# Altium schematic sheet Connectors.SchDoc: Connectors
size A3; DocumentNumber: 2; SheetNumber: 2; SheetTotal: 3
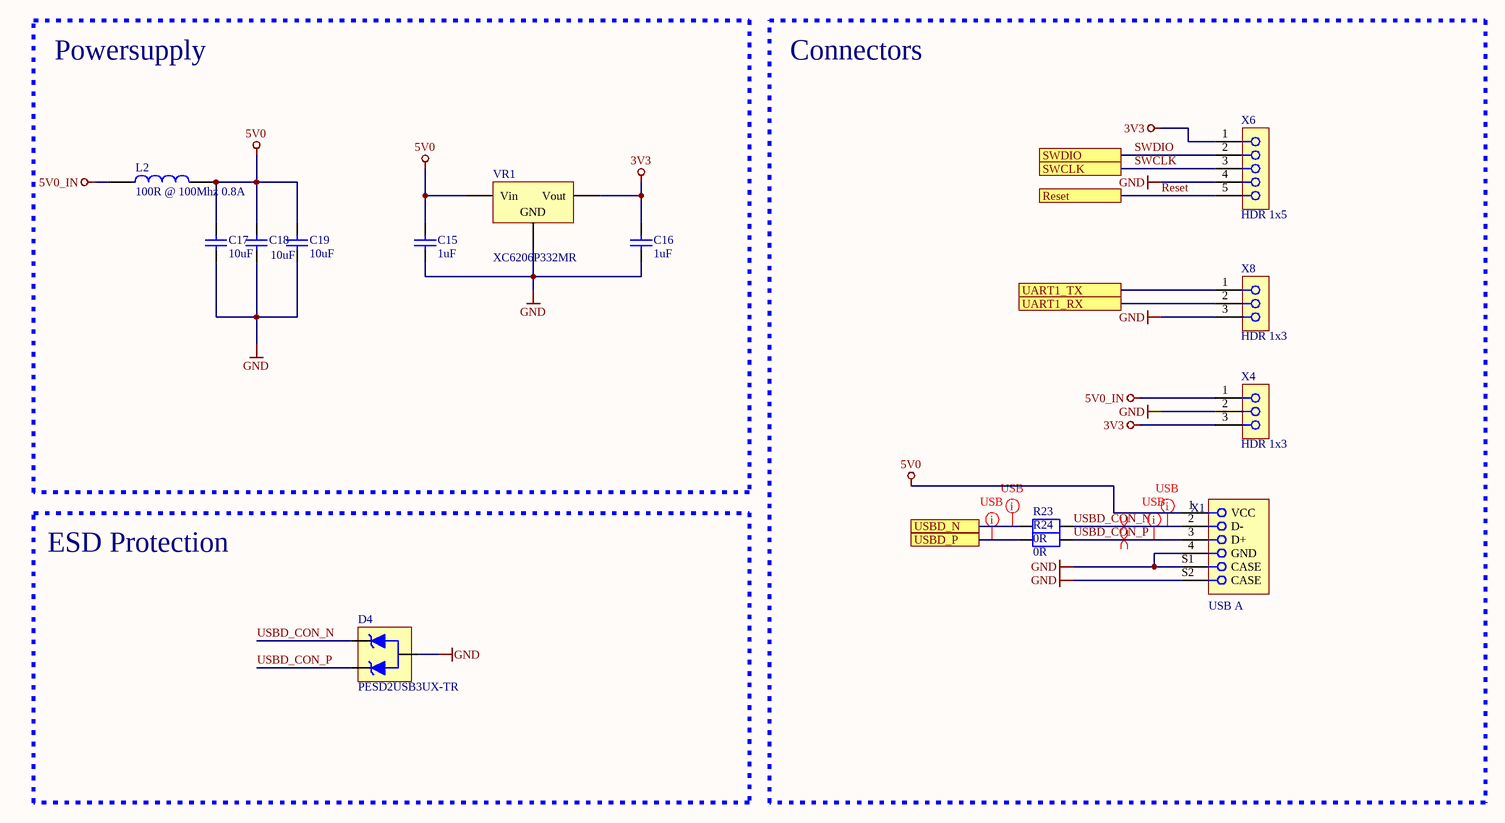
[diagram p0: Connectors.SchDoc]

## Parts
C15  1uF  [0603_C]
C16  1uF  [0603_C]
C17  10uF  [0805_C]
C18  10uF  [0805_C]
C19  10uF  [0805_C]
D4  PESD2USB3UX-TR  [SOT95P280X135-3N_123]
L2  100R @ 100Mhz 0.8A  [6-0805_L]
R23  0R  [RESC2012X70N]
R24  0R  [RESC2012X70N]
VR1  XC6206P332MR  [SOT-23-3L]
X1  USB A  [CON_USBA_F_61400416021]
X4  HDR 1x3  [CON_HEADER2.54_1x3W]
X6  HDR 1x5  [CON_HEADER2.54_1x5W]
X8  HDR 1x3  [CON_HEADER2.54_1x3W]

## Blocks framed on the sheet
Powersupply: C15-C19 L2 VR1
Connectors: R23 R24 X1 X4 X6 X8
ESD Protection: D4

## Ports
Reset, SWCLK, SWDIO, UART1_RX, UART1_TX, USBD_N, USBD_P

## Nets
3V3: C16.2 VR1.2(Vout) X4.3 X6.1
5V0: C15.2 C17.2 C18.2 C19.2 L2.2 VR1.3(Vin) X1.1(VCC)
5V0_IN: L2.1 X4.1
GND: C15.1 C16.1 C17.1 C18.1 C19.1 D4.3 VR1.1(GND) X1.4(GND) X1.S1(CASE) X1.S2(CASE) X4.2 X6.4 X8.3
Reset: X6.5 ; port Reset
SWCLK: X6.3 ; port SWCLK
SWDIO: X6.2 ; port SWDIO
UART1_RX: X8.2 ; port UART1_RX
UART1_TX: X8.1 ; port UART1_TX
USBD_CON_N: D4.1 R23.2 X1.2(D-)
USBD_CON_P: D4.2 R24.2 X1.3(D+)
USBD_N: R23.1 ; port USBD_N
USBD_P: R24.1 ; port USBD_P

## Layout directives
differential pair; net class USB; differential pair class USB_Line; rule Differential Pairs Routing [Pref Gap = 0.15mm    Min Gap  = 0.15mm    Max Gap  = 0.15mmPref Width = 0.5mm    Min Width  = 0.15mm    Max Width  = 0.5mm]: USBD_CON_N, USBD_CON_P
net class USB: USBD_CON_N, USBD_CON_P, USBD_N, USBD_P

## Notes on the sheet
- Title
- Size:
- Date:
- File:
- A4
- Revision:
- Sheet
- of
- Creator:
- Document Type: Schematic Drawing
- Approval Person:

## Library data of the parts
C15 C16 = 0603 1uF (105) 10% 50V: Chip capacitors; Manufacturer: Samsung Electro-Mechanics; PartNumber: CL10A105KB8NNNC; Tolerance: 10%; Voltage: 50V; ComponentLink1Description: Supplier link; ComponentLink1URL: http://www.szlcsc.com/product/details_16531.html; Package: 0603; Supplier: LC; SuppliersPartNumber: C15849; Capacitance: 1uF
C17-C19 = 0805 10uF (106) 10% 25V: Chip capacitors; Manufacturer: Samsung Electro-Mechanics; PartNumber: CL21A106KAYNNNE; Tolerance: 10%; Voltage: 25V; ComponentLink1Description: Supplier link; ComponentLink1URL: http://www.szlcsc.com/product/details_16532.html; Package: 0805; Supplier: LC; SuppliersPartNumber: C15850; Capacitance: 10uF
D4 = PESD2USB3UX-TR: ESD Suppressors / TVS Diodes DIODE ESD PROT; Manufacturer: Nexperia; Voltage Rating: 3.3V; Alternatives allowed: YES; Manufacturer Part Number: PESD2USB3UX-TR
L2 = 0805 100R@100Mhz 0.8A: Ferrite Bead; Notepad: *; Package: 0805; Supplier: Sunlord; SuppliersPartNumber: C1015
R23 R24 = RES_0R_0805: Thick Film Resistors - SMD 1/8watt ZEROohm Jumper; Manufacturer: Vishay; Manufacturer Part Number: CRCW08050000Z0EA; Voltage Rating: 150V; Tolerance: 1%; Alternatives allowed: YES; JLC: C17477
VR1 = SOT-23 XC6206P332MR: 低压差线性稳压(LDO); ComponentLink1Description: 供应商链接; ComponentLink1URL: http://www.szlcsc.com/product/details_5896.html; Package: SOT-23; Supplier: LC; SuppliersPartNumber: C5446
X1 = CON_USB_A_FEMALE: USB 2.0 Type A Horizontal; Manufacturer Part Number: 61400416021; Manufacturer: WURTH ELEKTRONIK; Lumira Part Number: S-QMS-SPEC-32510; Alternatives allowed: NO; Notes: *; Tolerance: *; Voltage Rating: *
X4 X8 = CON_HEADER_1X3: Board-to-Board-Steckverbinder, 2.54 mm, 3 Kontakt(e), Stiftleiste 1-Reihig; Manufacturer: Samtec; Manufacturer Part Number: TSW-103-07-T-S; Lumira Part Number: S-QMS-SPEC-32502; Alternatives allowed: YES
X6 = CON_HEADER_1X5: Board-to-Board-Steckverbinder, 2.54 mm, 5 Kontakt(e), Stiftleiste 1-Reihig; Manufacturer: Samtec; Manufacturer Part Number: TSW-105-07-T-S; Alternatives allowed: YES